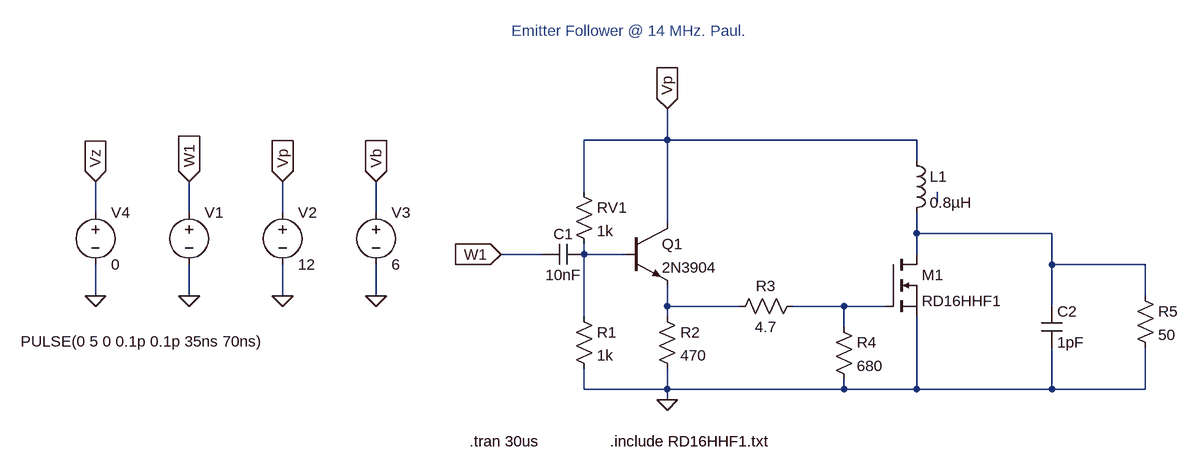
[diagram p0: schematic HF-PA-v1-Simulation-14-MHz-v7-Paul-RD16HHF1.asc]
HF-PA-v1-Simulation-14-MHz-v7-Paul-RD16HHF1.asc, the LTspice schematic file:
Version 4
SHEET 1 936 680
WIRE 144 -128 144 -176
WIRE 144 -128 16 -128
WIRE 528 -128 144 -128
WIRE 528 -96 528 -128
WIRE 16 -48 16 -128
WIRE 560 -32 560 -48
WIRE -736 -16 -736 -64
WIRE -592 -16 -592 -64
WIRE -448 -16 -448 -64
WIRE -304 -16 -304 -64
WIRE 144 0 144 -128
WIRE 528 16 528 -16
WIRE 736 16 528 16
WIRE -48 48 -112 48
WIRE 16 48 16 32
WIRE 80 48 16 48
WIRE 528 48 528 16
WIRE 736 64 736 16
WIRE 880 64 736 64
WIRE -736 112 -736 64
WIRE -592 112 -592 64
WIRE -448 112 -448 64
WIRE -304 112 -304 64
WIRE 880 112 880 64
WIRE 144 128 144 96
WIRE 256 128 144 128
WIRE 416 128 336 128
WIRE 480 128 416 128
WIRE 736 128 736 64
WIRE 16 144 16 48
WIRE 144 144 144 128
WIRE 416 160 416 128
WIRE 16 256 16 224
WIRE 144 256 144 224
WIRE 144 256 16 256
WIRE 416 256 416 240
WIRE 416 256 144 256
WIRE 528 256 528 144
WIRE 528 256 416 256
WIRE 736 256 736 192
WIRE 736 256 528 256
WIRE 880 256 880 192
WIRE 880 256 736 256
WIRE 144 272 144 256
FLAG -112 48 W1
IOPIN -112 48 In
FLAG 144 -176 Vp
IOPIN 144 -176 In
FLAG -592 112 0
FLAG -448 112 0
FLAG -592 -64 W1
IOPIN -592 -64 In
FLAG -448 -64 Vp
IOPIN -448 -64 In
FLAG 144 272 0
FLAG -304 112 0
FLAG -304 -64 Vb
IOPIN -304 -64 In
FLAG -736 -64 Vz
IOPIN -736 -64 In
FLAG -736 112 0
SYMBOL npn 80 0 R0
SYMATTR InstName Q1
SYMATTR Value 2N3904
SYMBOL res 128 128 R0
SYMATTR InstName R2
SYMATTR Value 470
SYMBOL voltage -592 -32 R0
WINDOW 3 -259 214 Left 2
WINDOW 123 0 0 Left 0
WINDOW 39 0 0 Left 0
SYMATTR Value PULSE(0 5 0 0.1p 0.1p 35ns 70ns)
SYMATTR InstName V1
SYMBOL voltage -448 -32 R0
WINDOW 123 0 0 Left 0
WINDOW 39 0 0 Left 0
SYMATTR InstName V2
SYMATTR Value 12
SYMBOL voltage -304 -32 R0
WINDOW 123 0 0 Left 0
WINDOW 39 0 0 Left 0
SYMATTR InstName V3
SYMATTR Value 6
SYMBOL res 0 -64 R0
SYMATTR InstName RV1
SYMATTR Value 1k
SYMBOL res 0 128 R0
SYMATTR InstName R1
SYMATTR Value 1k
SYMBOL res 352 112 R90
WINDOW 0 0 56 VBottom 2
WINDOW 3 32 56 VTop 2
SYMATTR InstName R3
SYMATTR Value 4.7
SYMBOL res 400 144 R0
SYMATTR InstName R4
SYMATTR Value 680
SYMBOL cap 16 32 R90
WINDOW 0 0 32 VBottom 2
WINDOW 3 32 32 VTop 2
SYMATTR InstName C1
SYMATTR Value 10nF
SYMBOL ind 512 -112 R0
SYMATTR InstName L1
SYMATTR Value 0.8µH
SYMBOL cap 720 128 R0
SYMATTR InstName C2
SYMATTR Value 1pF
SYMBOL voltage -736 -32 R0
WINDOW 123 0 0 Left 0
WINDOW 39 0 0 Left 0
SYMATTR InstName V4
SYMATTR Value 0
SYMBOL nmos 480 48 R0
SYMATTR InstName M1
SYMATTR Value RD16HHF1
SYMBOL res 864 96 R0
SYMATTR InstName R5
SYMATTR Value 50
TEXT -160 336 Left 2 !.tran 30us
TEXT -96 -296 Left 2 ;Emitter Follower @ 14 MHz. Paul.
TEXT 56 336 Left 2 !.include RD16HHF1.txt

The netlist it stands for:
* HF-PA-v1-Simulation-14-MHz-v7-Paul-RD16HHF1.asc
Q1 Vp N003 N004 0 2N3904
R2 N004 0 470
V1 W1 0 PULSE(0 5 0 0.1p 0.1p 35ns 70ns)
V2 Vp 0 12
V3 Vb 0 6
RV1 Vp N003 1k
R1 N003 0 1k
R3 N005 N004 4.7
R4 N005 0 680
C1 N003 W1 10nF
L1 Vp N002 0.8µH
C2 N002 0 1pF
V4 Vz 0 0
M1 N002 N005 0 0 RD16HHF1
R5 N002 0 50
.model NPN NPN
.model PNP PNP
.lib standard.bjt
.model NMOS NMOS
.model PMOS PMOS
.lib standard.mos
.tran 30us
* Emitter Follower @ 14 MHz. Paul.
.include RD16HHF1.txt
.backanno
.end